# Altium schematic sheet 2024 PD Board.SchDoc
size 381 x 508 mm
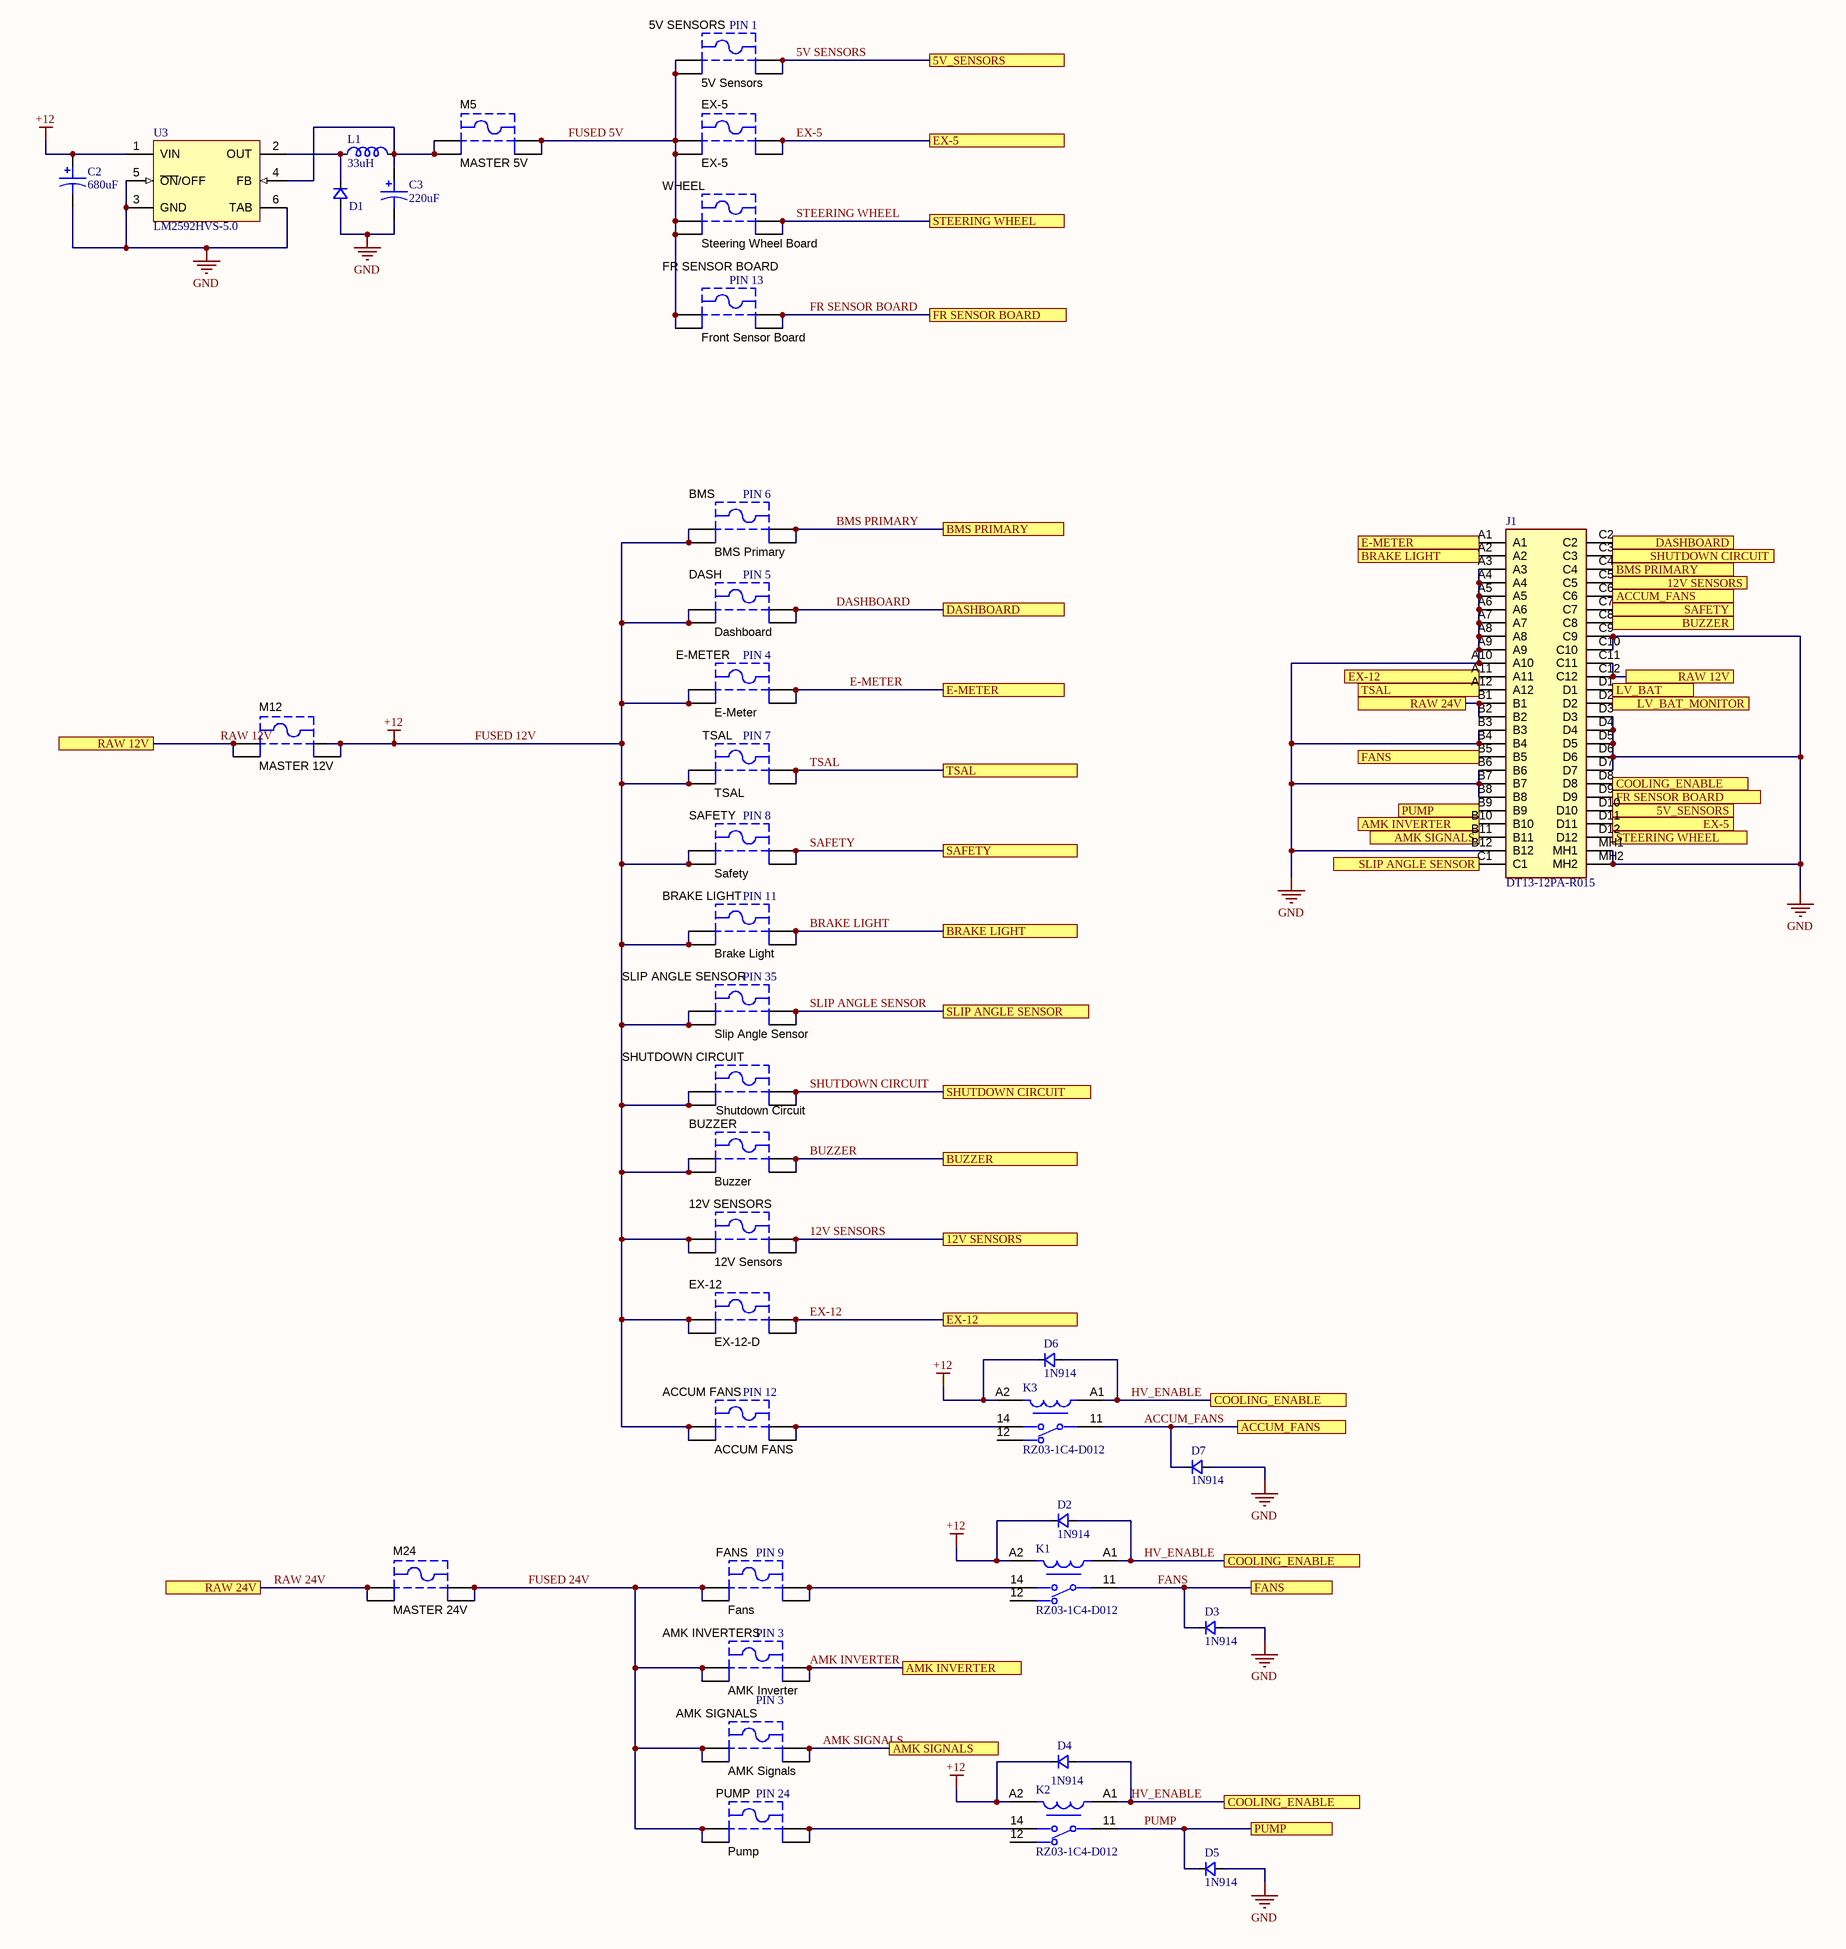
[diagram p0: 2024 PD Board.SchDoc]

## Parts
5V_SENSORS  5V Sensors  [KSTN-3568_V]
12V_SENSORS  12V Sensors  [KSTN-3568_V]
ACCUM_FANS  ACCUM FANS  [KSTN-3568_V]
AMK_INVERTERS  AMK Inverter  [KSTN-3568_V]
AMK_SIGNALS  AMK Signals  [KSTN-3568_V]
BMS  BMS Primary  [KSTN-3568_V]
BRAKE_LIGHT  Brake Light  [KSTN-3568_V]
BUZZER  Buzzer  [KSTN-3568_V]
C2  680uF  [CAP-6.3D7.7H-SMD]
C3  220uF  [CAP-6.3D7.7H-SMD]
D1  CMP-051-000011-1  [SOD123]  (value not drawn)
D2  1N914  [DO41-10]
D3  1N914  [DO41-10]
D4  1N914  [DO41-10]
D5  1N914  [DO41-10]
D6  1N914  [DO41-10]
D7  1N914  [DO41-10]
DASH  Dashboard  [KSTN-3568_V]
E-METER  E-Meter  [KSTN-3568_V]
EX-5  EX-5  [KSTN-3568_V]
EX-12  EX-12-D  [KSTN-3568_V]
FANS  Fans  [KSTN-3568_V]
FR_SENSOR_BOARD  Front Sensor Board  [KSTN-3568_V]
J1  DT13-12PA-R015  [DT1312PAR015]
K1  RZ03-1C4-D012  [FP-RZ03-1C4-D024-MFG]
K2  RZ03-1C4-D012  [FP-RZ03-1C4-D024-MFG]
K3  RZ03-1C4-D012  [FP-RZ03-1C4-D024-MFG]
L1  33uH  [IND-6045]
M5  MASTER 5V  [KSTN-3568_V]
M12  MASTER 12V  [KSTN-3568_V]
M24  MASTER 24V  [KSTN-3568_V]
PUMP  Pump  [KSTN-3568_V]
SAFETY  Safety  [KSTN-3568_V]
SHUTDOWN_CIRCUIT  Shutdown Circuit  [KSTN-3568_V]
SLIP_ANGLE_SENSOR  Slip Angle Sensor  [KSTN-3568_V]
TSAL  TSAL  [KSTN-3568_V]
U3  LM2592HVS-5.0  [KTT0005B_L]
WHEEL  Steering Wheel Board  [KSTN-3568_V]

## Ports
5V_SENSORS, 12V SENSORS, ACCUM_FANS, AMK INVERTER, AMK SIGNALS, BMS PRIMARY, BRAKE LIGHT, BUZZER, COOLING_ENABLE, DASHBOARD, E-METER, EX-5, EX-12, FANS, FR SENSOR BOARD, LV_BAT, LV_BAT_MONITOR, PUMP, RAW 12V, RAW 24V, SAFETY, SHUTDOWN CIRCUIT, SLIP ANGLE SENSOR, STEERING WHEEL, TSAL

## Nets
FUSED 12V: 12V_SENSORS.1 12V_SENSORS.2 ACCUM_FANS.1 ACCUM_FANS.2 BMS.1 BMS.2 BRAKE_LIGHT.1 BRAKE_LIGHT.2 BUZZER.1 BUZZER.2 C2.POS(+) D2.K D4.K D6.K DASH.1 DASH.2 E-METER.1 E-METER.2 EX-12.1 EX-12.2 K1.A2 K2.A2 K3.A2 M12.3 M12.4 SAFETY.1 SAFETY.2 SHUTDOWN_CIRCUIT.1 SHUTDOWN_CIRCUIT.2 SLIP_ANGLE_SENSOR.1 SLIP_ANGLE_SENSOR.2 TSAL.1 TSAL.2 U3.1(VIN)  [also labelled +12]
GND: C2.NEG(-) C3.NEG(-) D1.A D3.A D5.A D7.A J1.A3 J1.A4 J1.A5 J1.A6 J1.A7 J1.A8 J1.A9 J1.A10 J1.B3 J1.B4 J1.B6 J1.B7 J1.B8 J1.B12 J1.C9 J1.C10 J1.D3 J1.D4 J1.D5 J1.D6 J1.D7 J1.MH1 J1.MH2 U3.3(GND) U3.5(~{ON}/OFF) U3.6(TAB)
5V SENSORS: 5V_SENSORS.3 5V_SENSORS.4 J1.D10 ; port 5V_SENSORS
12V SENSORS: 12V_SENSORS.3 12V_SENSORS.4 J1.C5 ; port 12V SENSORS
ACCUM_FANS: D7.K J1.C6 K3.11 ; port ACCUM_FANS
AMK INVERTER: AMK_INVERTERS.3 AMK_INVERTERS.4 J1.B10 ; port AMK INVERTER
AMK SIGNALS: AMK_SIGNALS.3 AMK_SIGNALS.4 J1.B11 ; port AMK SIGNALS
BMS PRIMARY: BMS.3 BMS.4 J1.C4 ; port BMS PRIMARY
BRAKE LIGHT: BRAKE_LIGHT.3 BRAKE_LIGHT.4 J1.A2 ; port BRAKE LIGHT
BUZZER: BUZZER.3 BUZZER.4 J1.C8 ; port BUZZER
DASHBOARD: DASH.3 DASH.4 J1.C2 ; port DASHBOARD
E-METER: E-METER.3 E-METER.4 J1.A1 ; port E-METER
EX-5: EX-5.3 EX-5.4 J1.D11 ; port EX-5
EX-12: EX-12.3 EX-12.4 J1.A11 ; port EX-12
FANS: D3.K J1.B5 K1.11 ; port FANS
FR SENSOR BOARD: FR_SENSOR_BOARD.3 FR_SENSOR_BOARD.4 J1.D9 ; port FR SENSOR BOARD
FUSED 5V: 5V_SENSORS.1 5V_SENSORS.2 EX-5.1 EX-5.2 FR_SENSOR_BOARD.1 FR_SENSOR_BOARD.2 M5.3 M5.4 WHEEL.1 WHEEL.2
FUSED 24V: AMK_INVERTERS.1 AMK_INVERTERS.2 AMK_SIGNALS.1 AMK_SIGNALS.2 FANS.1 FANS.2 M24.3 M24.4 PUMP.1 PUMP.2
HV_ENABLE: D2.A D4.A D6.A J1.D8 K1.A1 K2.A1 K3.A1 ; port COOLING_ENABLE
LV_BAT: J1.D1 ; port LV_BAT
LV_BAT_MONITOR: J1.D2 ; port LV_BAT_MONITOR
PUMP: D5.K J1.B9 K2.11 ; port PUMP
RAW 12V: J1.C11 J1.C12 M12.1 M12.2 ; port RAW 12V
RAW 24V: J1.B1 J1.B2 M24.1 M24.2 ; port RAW 24V
SAFETY: J1.C7 SAFETY.3 SAFETY.4 ; port SAFETY
SHUTDOWN CIRCUIT: J1.C3 SHUTDOWN_CIRCUIT.3 SHUTDOWN_CIRCUIT.4 ; port SHUTDOWN CIRCUIT
SLIP ANGLE SENSOR: J1.C1 SLIP_ANGLE_SENSOR.3 SLIP_ANGLE_SENSOR.4 ; port SLIP ANGLE SENSOR
STEERING WHEEL: J1.D12 WHEEL.3 WHEEL.4 ; port STEERING WHEEL
TSAL: J1.A12 TSAL.3 TSAL.4 ; port TSAL
NetACCUM_FANS_3: ACCUM_FANS.3 ACCUM_FANS.4 K3.14
NetC3_POS: C3.POS(+) L1.2 M5.1 M5.2 U3.4(FB)
NetD1_K: D1.K L1.1 U3.2(OUT)
NetFANS_3: FANS.3 FANS.4 K1.14
NetK2_14: K2.14 PUMP.3 PUMP.4

Not connected (* = marked no-connect by the designer): K1 12; K2 12; K3 12

## Notes on the sheet
- (near 5V_SENSORS) PIN 1
- PIN 13
- (near BMS) PIN 6
- PIN 5
- PIN 4
- PIN 7
- PIN 8
- PIN 11
- PIN 35
- (near ACCUM_FANS) PIN 12
- (near FANS) PIN 9
- PIN 3
- (near AMK_INVERTERS) PIN 3
- PIN 24
- DWG. NO.
- REV.
- SHT.
- THIS DOCUMENT AND THE DATA DISCLOSED HEREIN OR HEREWITH IS THE PROPERTY OF ALTIUM LIMITED AND MAY BE FREELY DISTRIBUTED IN WHOLE. NO RIGHTS ARE RESERVED OR EXPRESS OR IMPLIED WARANTEE GIVEN.
- REVISION
- DESCRIPTION
- DATE
- APPROVED
- ENG:
- APPROVALS
- PROJECT
- DSN:
- CHK:
- REFERENCE DOCUMENTS
- PROJECT REVISION:
- TITLE
- DOCUMENT REVISION:
- DESIGN ITEM:
- BOM:
- FAB DWG:
- PCB DWG:
- ASSY DWG:
- SCALE:
- SIZE
- B
- CAGE CODE
- FILE NAME
- DWG NO.
- SHEET
- OF
- REV

## Library data of the parts
5V_SENSORS 12V_SENSORS ACCUM_FANS AMK_INVERTERS AMK_SIGNALS BMS BRAKE_LIGHT BUZZER DASH E-METER EX-5 EX-12 FANS FR_SENSOR_BOARD M5 M12 M24 PUMP SAFETY SHUTDOWN_CIRCUIT SLIP_ANGLE_SENSOR TSAL WHEEL = CMP-2000-05464-1: Fuse Holder, 20 A, 500 V, -50 to 145 degC, 4-Pin THD, RoHS; Manufacturer: Keystone; Package Reference: 3568; Datasheet Version: 04/2013; Datasheet URL: https://datasheet.ciiva.com/16294/m60-2p40-16294706.pdf; Manufacturer URL: http://www.keyelco.com/; Mounting Technology: ThroughHole; Package Description: 4-Pin Through Hole Device, Body 16 x 6.73 mm, Pitch 9.9 mm
C2 C3 = CMP-050-000005-1: Source: ife19_Elec_Library.SchLib; Design Item ID: CAP-6.3D7.7H-SMD
D2-D7 = CMP-010-000010-1: Design Item ID: DIODE-DO41-10; Source: ife19_Elec_Library.SchLib
J1 = CMP-057-000070-1: Automotive Connectors EEC HEADER; Manufacturer_Name: TE Connectivity; Geometry.Height: 53.25mm; Mouser Price/Stock: https://www.mouser.co.uk/ProductDetail/TE-Connectivity-DEUTSCH/DT13-12PA-R015?qs=cgQJD%2FpJz0xZmI47WX6OlA%3D%3D; Source: DT13-12PA-R015.SchLib; Datasheet Link: https://www.te.com/commerce/DocumentDelivery/DDEController?Action=showdoc&DocId=Customer+Drawing%7FDT13-XPX-R015%7F-%7Fpdf%7FEnglish%7FENG_CD_DT13-XPX-R015_-.pdf%7FDT13-12PA-R015; Manufacturer_Part_Number: DT13-12PA-R015; Mouser Part Number: 571-DT13-12PA-R015; Design Item ID: DT13-12PA-R015
K1-K3 = CMP-03395-000132-1: RELAY GEN PURPOSE SPDT 16A 24V; Manufacturer Part Number: RZ03-1C4-D024; Manufacturer: TE Connectivity; Coil Power: 400mW; Coil Type: Non-Latching; Number Of Contacts: 1; Coil Resistance: 1440Ω; Device Class L1: Electromechanical; ComponentLink2URL: https://www.te.com/commerce/DocumentDelivery/DDEController?Action=showdoc&DocId=Data+Sheet%7FRZ%7F0918%7Fpdf%7FEnglish%7FENG_DS_RZ_0918.pdf%7F2-1415899-3; Ambient Temperature Range Low: -40°C; Package: RZ03-1C4-D024; Ambient Temperature Range High: +85°C; Coil Voltage: 24V; Current Rating: 16A; RoHS: TRUE; Automotive: No; Height: 15.7mm; Category: Relay; Device Class L2: Relays; Digikey Description: RELAY GEN PURPOSE SPDT 16A 24V; ComponentLink2Description: Datasheet; Throw Configuration: SPDT; Device Class L3: Power Relays; Octopart: https://octopart.com/2-1415899-3-te+connectivity-44326503; Lead Free: Yes
L1 = CMP-052-000004-1: Source: ife19_Elec_Library.SchLib; Design Item ID: IND-6045
U3 = CMP-0069-00241-3: SIMPLE SWITCHER® Power Converter 150 KHz 2A Step-Down Voltage Regulator, 5-pin TO-263; Manufacturer: Texas Instruments; PowerWise: N; PackageTopMarking: NSUZXYTTE#*LM2592HVS*-5.0 P+; RoHS: N; PinCount: 5; PackageReference: KTT0005B; Code_JEDEC: MO-169-AB; ComponentLink1URL: http://www.ti.com/general/docs/lit/getliterature.tsp?genericPartNumber=LM2592HV&fileType=pdf; PackageDescription: TO-263, Molded, .400 x .390 x .180in, 5 Lead, .067in Pitch, Surface Mount; CompType: Switcher; ComponentLink1Description: Datasheet URL
D1 = CMP-051-000011-1: Source: ife19_Elec_Library.SchLib; Design Item ID: DIODE-SOD123